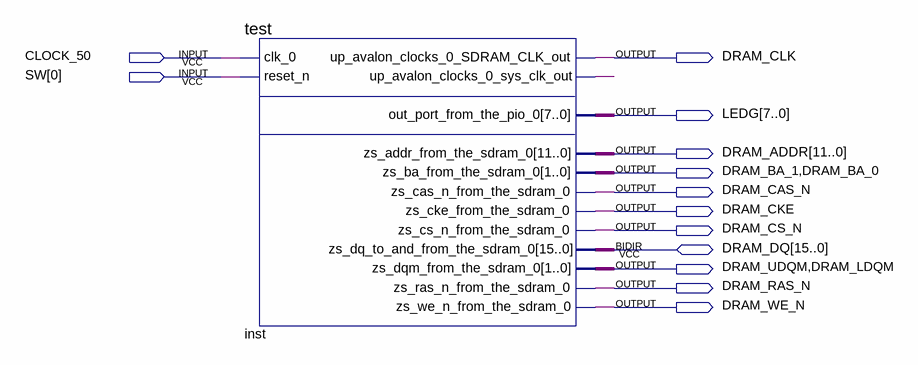
[diagram p0: schematic sheet]
// Quartus schematic Block1.bdf as structural Verilog: 1 symbols, 13 pins
module Block1 (
  input  CLOCK_50,
  input  [0:0] SW,
  inout  [15:0] DRAM_DQ,
  output DRAM_CLK,
  output [7:0] LEDG,
  output [11:0] DRAM_ADDR,
  output DRAM_BA_1,
  output DRAM_BA_0,
  output DRAM_CAS_N,
  output DRAM_CKE,
  output DRAM_CS_N,
  output DRAM_UDQM,
  output DRAM_LDQM,
  output DRAM_RAS_N,
  output DRAM_WE_N
);

  wire inst_up_avalon_clocks_0_sys_clk_out;

  test inst (
    .clk_0(CLOCK_50), .reset_n(SW[0]), .up_avalon_clocks_0_SDRAM_CLK_out(DRAM_CLK),
    .up_avalon_clocks_0_sys_clk_out(inst_up_avalon_clocks_0_sys_clk_out), .out_port_from_the_pio_0(LEDG),
    .zs_addr_from_the_sdram_0(DRAM_ADDR), .zs_ba_from_the_sdram_0({DRAM_BA_1, DRAM_BA_0}),
    .zs_cas_n_from_the_sdram_0(DRAM_CAS_N), .zs_cke_from_the_sdram_0(DRAM_CKE),
    .zs_cs_n_from_the_sdram_0(DRAM_CS_N), .zs_dqm_from_the_sdram_0({DRAM_UDQM, DRAM_LDQM}),
    .zs_ras_n_from_the_sdram_0(DRAM_RAS_N), .zs_we_n_from_the_sdram_0(DRAM_WE_N),
    .zs_dq_to_and_from_the_sdram_0(DRAM_DQ));
endmodule
